# Altium schematic sheet Sensors and peripherals.SchDoc
size A3; SheetNumber: 4; SheetTotal: 6
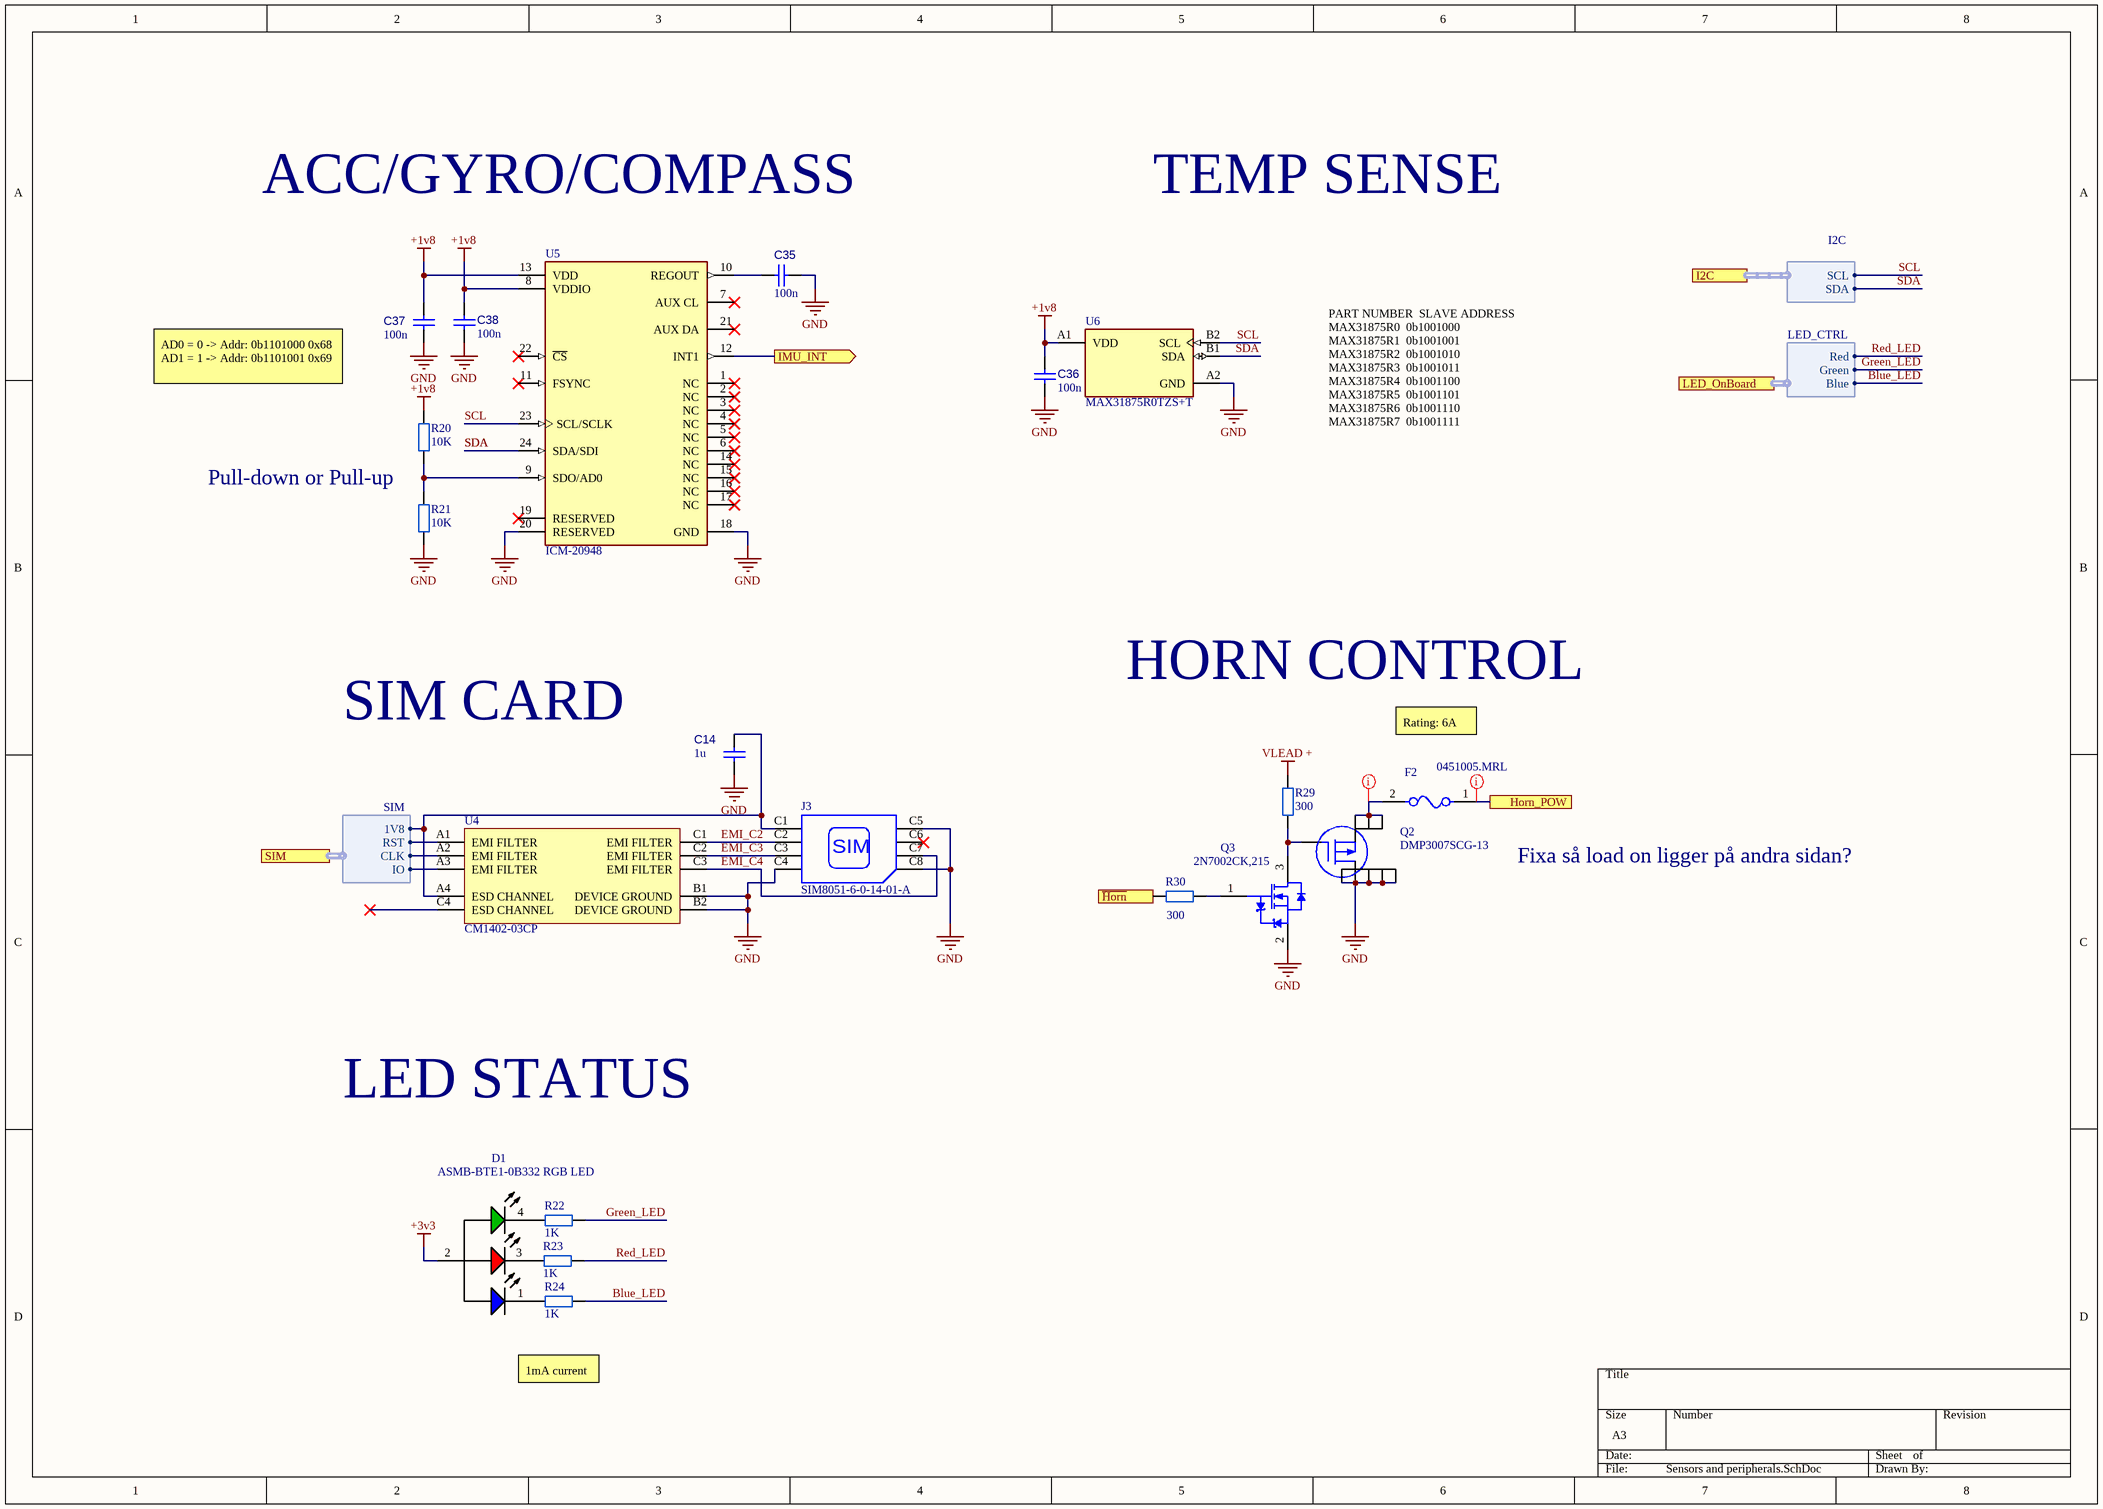
[diagram p0: Sensors and peripherals.SchDoc]

## Parts
C14  value 1u  [CAPC1608X90X40LL10T20 HD]  (hidden comment: Capacitor 0603)
C35  value 100n  [CAPC1005X55X25LL05T10 HD]  (hidden comment: Capacitor 0402)
C36  value 100n  [CAPC1005X55X25LL05T10 HD]  (hidden comment: Capacitor 0402)
C37  value 100n  [CAPC1005X55X25LL05T10 HD]  (hidden comment: Capacitor 0402)
C38  value 100n  [CAPC1005X55X25LL05T10 HD]  (hidden comment: Capacitor 0402)
D1  ASMB-BTE1-0B332 RGB LED  [FP-ASMB-BTE1-0B332-MFG]
F2  0451005.MRL  [FP-0451-MFG]
J3  SIM8051-6-0-14-01-A  [FP-SIM8051-6-0-14-01-A-MFG]
Q2  DMP3007SCG-13  [DMP3007SCG13]
Q3  2N7002CK,215  [NXP-SOT23_N]
R20  value 10K  [RESC1005X40X25LL10T10 HD]  (hidden comment: Resistor 0403)
R21  value 10K  [RESC1005X40X25LL10T10 HD]  (hidden comment: Resistor 0403)
R22  value 1K  [RESC1005X40X25LL10T10 HD]  (hidden comment: Resistor 0403)
R23  value 1K  [RESC1005X40X25LL10T10 HD]  (hidden comment: Resistor 0403)
R24  value 1K  [RESC1005X40X25LL10T10 HD]  (hidden comment: Resistor 0403)
R29  value 300  [RESC1608X55X25ML10T15]  (hidden comment: Resistor 0603)
R30  value 300  [RESC1608X55X25ML10T15]  (hidden comment: Resistor 0603)
U4  CM1402-03CP  [ONSC-WLCSP-10-567BL-01]
U5  ICM-20948  [FP-ICM-20948-IPC_A]
U6  MAX31875R0TZS+T  [FP-Z40C0-1-MFG]

## Ports
Horn_POW, I2C (harness I2C), IMU_INT (out), LED_OnBoard (harness LED_CTRL), SIM (harness SIM), ~{Horn} (in)

## Harnesses
I2C: SCL, SDA
SIM: 1V8, RST, CLK, IO
LED_CTRL: Red, Green, Blue

## Nets
+1v8: C36.2 C37.2 C38.2 R20.2 U5.8(VDDIO) U5.13(VDD) U6.A1(VDD)
+3v3: D1.2(Common_Anode)
GND: C14.1 C35.1 C36.1 C37.1 C38.1 J3.C4(SHLD) J3.C5(GND) J3.C8(SHLD) Q2.5(D) Q2.6(D) Q2.7(D) Q2.8(D) Q2.9(D) Q3.2(S) R21.1 U4.B1(DEVICE_GROUND) U4.B2(DEVICE_GROUND) U5.18(GND) U5.20(RESERVED) U6.A2(GND)
VLEAD +: R29.2
Blue_LED: R24.1 ; port LED_OnBoard.Blue
EMI_C2: J3.C2(RST) U4.C1(EMI_FILTER)
EMI_C3: J3.C3(CLK) U4.C2(EMI_FILTER)
EMI_C4: J3.C7(I/O) U4.C3(EMI_FILTER)
Green_LED: R22.1 ; port LED_OnBoard.Green
~{Horn}: R30.1 ; port ~{Horn}
Horn_POW: F2.1 ; port Horn_POW
IMU_INT: U5.12(INT1) ; port IMU_INT
Red_LED: R23.1 ; port LED_OnBoard.Red
SCL: U5.23(SCL/SCLK) U6.B2(SCL) ; port I2C.SCL
SDA: U5.24(SDA/SDI) U6.B1(SDA) ; port I2C.SDA
NetC14_2: C14.2 J3.C1(VCC) U4.A4(ESD_CHANNEL) ; port SIM.1V8
NetC35_2: C35.2 U5.10(REGOUT)
NetD1_1: D1.1(Cathode(Blue)) R24.2
NetD1_3: D1.3(Cathode(Red)) R23.2
NetD1_4: D1.4(Cathode(Green)) R22.2
NetF2_2: F2.2 Q2.1(S) Q2.2(S) Q2.3(S)
NetQ2_4: Q2.4(G) Q3.3(D) R29.1
NetQ3_1: Q3.1(G) R30.2
NetR20_1: R20.1 R21.2 U5.9(SDO/AD0)
NetU4_A1: U4.A1(EMI_FILTER) ; port SIM.RST
NetU4_A2: U4.A2(EMI_FILTER) ; port SIM.CLK
NetU4_A3: U4.A3(EMI_FILTER) ; port SIM.IO

Not connected (* = marked no-connect by the designer): J3 C6(VPP)*; U4 C4(ESD_CHANNEL)*; U5 1(NC)* 2(NC)* 3(NC)* 4(NC)* 5(NC)* 6(NC)* 7(AUX_CL)* 11(FSYNC)* 14(NC)* 15(NC)* 16(NC)* 17(NC)* 19(RESERVED)* 21(AUX_DA)* 22(~{CS})*

## Layout directives
net class High Power; rule Supply Nets [Voltage = 14.00]: Horn_POW
net class High Power: NetF2_2

## Notes on the sheet
- ACC/GYRO/COMPASS
- TEMP SENSE
- AD0 = 0 -> Addr: 0b1101000 0x68
  AD1 = 1 -> Addr: 0b1101001 0x69
- PART NUMBER 	SLAVE ADDRESS
  MAX31875R0 	0b1001000
  MAX31875R1 	0b1001001
  MAX31875R2 	0b1001010
  MAX31875R3 	0b1001011
  MAX31875R4 	0b1001100
  MAX31875R5 	0b1001101
  MAX31875R6 	0b1001110
  MAX31875R7 	0b1001111
- Pull-down or Pull-up
- HORN CONTROL
- SIM CARD
- Rating: 6A
- Fixa så load on ligger på andra sidan?
- LED STATUS
- 1mA current
- (in symbol CMP-002-00073-2) SIM

## Library data of the parts
C14 = CMP-001-00014-13: Chip Capacitor, 0603 (1608 Metric); Voltage Rating: ?V; Tolerance: ?%; Max Operating Temperature: Ceramic; Pins: 2; Case/Package: 0603; Mounting Technology: SMT
C35-C38 = CMP-001-00008-14: Chip Capacitor, 0402 (1005 Metric); Tolerance: ?%; Capacitor Type: Ceramic; Voltage Rating: ?V; Case/Package: 0402; Pins: 2; Mounting Technology: SMT
D1 = CMP-005-000000-1: LED RGB DIFFUSED 4PLCC SMD; Manufacturer: Broadcom; Forward Voltage: 3.1/3.1/2.1V; Wavelength: 469/529/622nm; Led Orientation: Top View; Peak Emmision Wavelength: 464/521/629nm; Power Dissipation: 90/90/78mW; Forward Current: 20mA; Reverse Voltage: 4V; Max Junction Temp: +110°C; Viewing Angle: 110°; Luminous Intensity: 350/1500/630mcd; Colour: Blue, Green, Red; Device Class L2: LEDs; Package: 0; Manufacturer Part Number: ASMB-BTE1-0B332; Category: Diode; Lead Free: Yes; Device Class L1: Optoelectronics; Temperature: -40°C to +100°C; Design Item ID: ASMB-BTE1-0B332 RGB LED; RoHS: TRUE; Octopart: https://octopart.com/asmb-bte1-0b332-broadcom-71127192; Automotive: No; Device Class L3: unset; Digikey Description: LED RGB DIFFUSED 4PLCC SMD; Height: 2.1mm; Temperature Range Low: -40°C; Temperature Range High: +100°C; Source: Moto Symbol Lib.SchLib
F2 = CMP-2000-05653-2: FUSE BRD MNT 5A 125VAC/VDC 2SMD; Manufacturer: Littelfuse Inc; Fuse Blow Speed: Fast; Voltage Rating: 125V; Fuse Interrupt Ac Current: 50A; Value: 0.0125Ω; Fuse I2T: 5.566A2Sec; Device Class L3: unset; Temperature Range Low: -55°C; Height: 2.94mm; Category: Fuse; Fuse Current: 5A; Octopart: https://octopart.com/0451005.mrl-littelfuse-566389; Package: 0451; RoHS: TRUE; Manufacturer Part Number: 0451005.MRL; Mouser Description: Surface Mount Fuses 125V 5A; Device Class L2: Fuses; ComponentLink2URL: https://www.littelfuse.com/~/media/electronics/datasheets/fuses/littelfuse_fuse_451_453_datasheet.pdf.pdf; Temperature Range High: +125°C; Digikey Description: FUSE BRD MNT 5A 125VAC/VDC 2SMD; Device Class L1: Circuit Protection; Automotive: No; Fuse Interrupt Dc Current: 50A; Temperature: -55°C to +125°C; Max Fuse Dc Voltage: 125V; Resistance: 0.0125Ω; ComponentLink2Description: Datasheet; Max Fuse Ac Voltage: 125V; Lead Free: Yes
J3 = CMP-002-00073-2: Push-Pull 6P 1.35mmH 3µ" gold with peg and logo Nano SIM Card Connector
Q2 = CMP-028-000000-2: Trans MOSFET P-CH 30V 50A 8-Pin VDFN EP T/R; Manufacturer_Name: Diodes Inc.; Source: Moto Symbol Lib.SchLib; Height: 0.85mm; Mouser Price/Stock: https://www.mouser.co.uk/ProductDetail/Diodes-Incorporated/DMP3007SCG-13?qs=lqAf%2FiVYw9j1j9A9Mlh%252Bjg%3D%3D; Design Item ID: DMP3007SCG-13; Manufacturer_Part_Number: DMP3007SCG-13; Arrow Price/Stock: https://www.arrow.com/en/products/dmp3007scg-13/diodes-incorporated; Arrow Part Number: DMP3007SCG-13; Mouser Part Number: 621-DMP3007SCG-13; Datasheet Link: https://componentsearchengine.com/Datasheets/1/DMP3007SCG-13.pdf
Q3 = CMP-1259-00088-1: N-Channel Trench MOSFET, 60 V, 0.3 A, -55 to 150 degC, 3-Pin SOT23, Tape and Reel; Manufacturer: NXP Semiconductors; Channel Type: N; Packing: Tape & Reel; VGSth [typ] (V): 1.75; Automotive Qualified: Y; ID [max] (A): 0.3; IDM [max] (A): 1.2; VDS [max] (V): 60; DatasheetVersion: Rev. 01; ComponentLink3URL: http://www.nxp.com/documents/outline_drawing/sot023_po.pdf; PackageVersion: 06-03-16, 03/2006; ComponentLink3Description: Package Specification; ComponentLink1Description: Manufacturer URL; Mounting Technology: Surface Mount; ComponentLink1URL: http://www.nxp.com/; Code_JEDEC: TO-236AB; ComponentLink2URL: http://www.nxp.com/documents/data_sheet/2N7002CK.pdf; PackageDescription: 3-Pin Small Outline Transistor Package, Body 2.9 x 1.3 mm, Pitch 0.95 mm; PackageReference: SOT23; PartNumber: 2N7002CK,215; ComponentLink2Description: Datasheet
R20-R24 = CMP-009-00178-4: Package: 0403; Design Item ID: Resistor EU; Source: Moto Symbol Lib.SchLib
R29 R30 = CMP-009-000000-4: Design Item ID: Resistor EU; Source: Moto Symbol Lib.SchLib
U4 = CMP-1066-00070-1: SIM Card EMI Filter Array with ESD Protection, -40 to 85 degC, 10-Pin WLCSP, Pb-Free, Tape and Reel; Manufacturer: On Semiconductor; C Typ (pF): 20; Number of Lines: 4; ComponentLink3Description: Package Specification; PackageDescription: 10-Ball Wafer Level Chip Scale Package, Body 1.96 x 1.33 mm; PartNumber: CM1402-03CP; ComponentLink1URL: http://www.onsemi.com/; PackageReference: WLCSP-10-567BL-01; ComponentLink1Description: Manufacturer URL; RoHS: Pb-Free; Mounting Technology: Surface Mount; ComponentLink3URL: http://www.onsemi.com/pub_link/Collateral/567BL.PDF; ComponentLink2URL: http://www.onsemi.com/pub_link/Collateral/CM1402-D.PDF; PackageVersion: Rev. O, 07/2010; Packing: Tape and Reel; DatasheetVersion: Rev. 4; ComponentLink2Description: Datasheet
U5 = CMP-000008-2: IMU ACCEL/GYRO/COMPI2C/SPI 24QFN
U6 = CMP-010-00024-1: The MAX31875 is a ±1°C-Accurate Local Temperature Sensor with I2C/SMBus Interface.